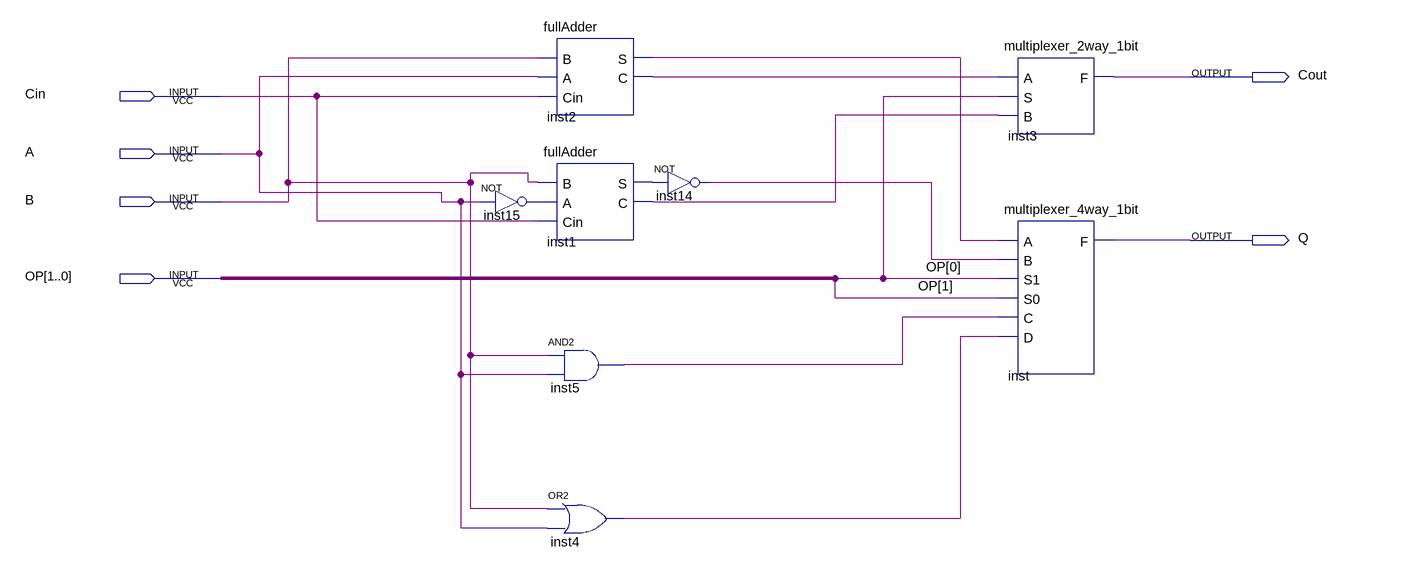
[diagram p0: schematic sheet]
// Quartus schematic alu_1bit.bdf as structural Verilog: 8 symbols, 6 pins
module alu_1bit (
  input  Cin,
  input  A,
  input  B,
  input  [1:0] OP,
  output Cout,
  output Q
);

  wire inst1_c, inst1_s, inst2_c, inst2_s, inst4_out, inst5_out, inst14_out, inst15_out;

  not inst15 (inst15_out, A);
  fullAdder inst2 (.B(B), .A(A), .Cin(Cin), .S(inst2_s), .C(inst2_c));
  fullAdder inst1 (.B(B), .A(inst15_out), .Cin(Cin), .S(inst1_s), .C(inst1_c));
  and inst5 (inst5_out, B, A);
  or inst4 (inst4_out, B, A);
  not inst14 (inst14_out, inst1_s);
  multiplexer_2way_1bit inst3 (.A(inst2_c), .S(OP[0]), .B(inst1_c), .F(Cout));
  multiplexer_4way_1bit inst (.A(inst2_s), .B(inst14_out), .S1(OP[0]), .S0(OP[1]), .C(inst5_out), .D(inst4_out), .F(Q));
endmodule
